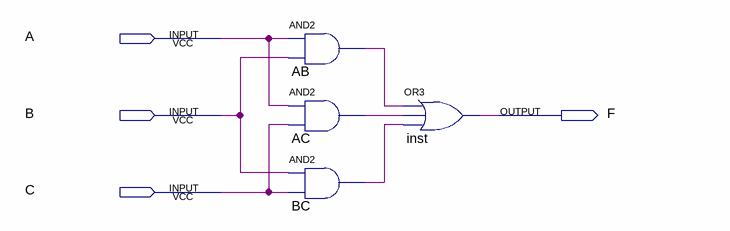
[diagram p0: schematic sheet]
// Quartus schematic Question2.bdf as structural Verilog: 4 symbols, 4 pins
module Question2 (
  input  A,
  input  B,
  input  C,
  output F
);

  wire AB_out, AC_out, BC_out;

  and AB (AB_out, A, B);
  and AC (AC_out, A, C);
  and BC (BC_out, B, C);
  or inst (F, AB_out, AC_out, BC_out);
endmodule
